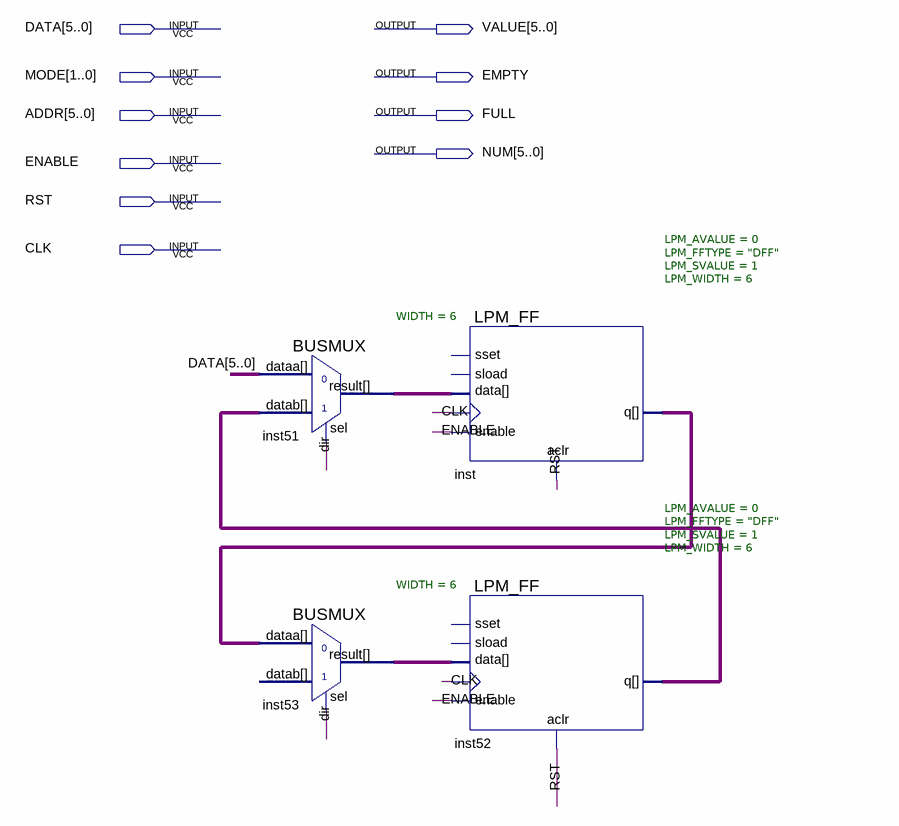
[diagram p0: schematic sheet]
// Quartus schematic g55_stack52.bdf as structural Verilog: 4 symbols, 10 pins
module g55_stack52 (
  input  [5:0] DATA,
  input  [1:0] MODE,
  input  [5:0] ADDR,
  input  ENABLE,
  input  RST,
  input  CLK,
  output [5:0] VALUE,
  output EMPTY,
  output FULL,
  output [5:0] NUM
);

  wire dir;
  wire [5:0] inst51_result, inst52_q, inst53_result, inst_q;

  BUSMUX #(.WIDTH(6)) inst51 (.datab(inst52_q), .sel(dir), .dataa(DATA), .result(inst51_result));
  BUSMUX #(.WIDTH(6)) inst53 (.sel(dir), .dataa(inst_q), .result(inst53_result));  // open: datab
  LPM_FF #(.LPM_AVALUE(0), .LPM_FFTYPE("DFF"), .LPM_SVALUE(1), .LPM_WIDTH(6)) inst (
    .aclr(RST), .clock(CLK), .data(inst51_result), .enable(ENABLE), .q(inst_q));  // open: sload, sset
  LPM_FF #(.LPM_AVALUE(0), .LPM_FFTYPE("DFF"), .LPM_SVALUE(1), .LPM_WIDTH(6)) inst52 (
    .aclr(RST), .clock(CLK), .data(inst53_result), .enable(ENABLE), .q(inst52_q));  // open: sload, sset
endmodule
